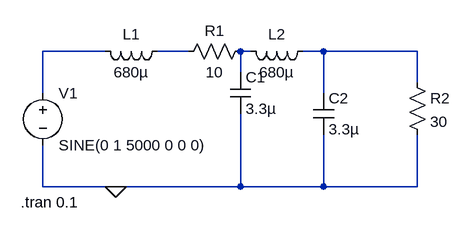
[diagram p0: schematic cascaded_RLC.asc]
cascaded_RLC.asc, the LTspice schematic file:
Version 4
SHEET 1 880 680
WIRE 48 64 -48 64
WIRE 176 64 128 64
WIRE 272 64 256 64
WIRE 384 64 352 64
WIRE 528 64 384 64
WIRE 256 96 256 64
WIRE 528 112 528 64
WIRE -48 128 -48 64
WIRE 384 128 384 64
WIRE -48 272 -48 208
WIRE 64 272 -48 272
WIRE 256 272 256 160
WIRE 256 272 64 272
WIRE 384 272 384 192
WIRE 384 272 256 272
WIRE 528 272 528 192
WIRE 528 272 384 272
FLAG 64 272 0
SYMBOL voltage -48 112 R0
WINDOW 123 0 0 Left 0
WINDOW 39 0 0 Left 0
SYMATTR InstName V1
SYMATTR Value SINE(0 1 5000 0 0 0)
SYMBOL ind 144 48 R90
WINDOW 0 5 56 VBottom 2
WINDOW 3 32 56 VTop 2
SYMATTR InstName L1
SYMATTR Value 680µ
SYMBOL res 272 48 R90
WINDOW 0 0 56 VBottom 2
WINDOW 3 32 56 VTop 2
SYMATTR InstName R1
SYMATTR Value 10
SYMBOL cap 240 96 R0
SYMATTR InstName C1
SYMATTR Value 3.3µ
SYMBOL cap 368 128 R0
SYMATTR InstName C2
SYMATTR Value 3.3µ
SYMBOL ind 368 48 R90
WINDOW 0 5 56 VBottom 2
WINDOW 3 32 56 VTop 2
SYMATTR InstName L2
SYMATTR Value 680µ
SYMBOL res 512 96 R0
SYMATTR InstName R2
SYMATTR Value 30
TEXT -82 296 Left 2 !.tran 0.1

The netlist it stands for:
* cascaded_RLC.asc
V1 N001 0 SINE(0 1 5000 0 0 0)
L1 N002 N001 680µ
R1 N003 N002 10
C1 N003 0 3.3µ
C2 N004 0 3.3µ
L2 N004 N003 680µ
R2 N004 0 30
.tran 0.1
.backanno
.end